# Altium schematic sheet M5-RelayDriver.SchDoc
size A4; ApprovedBy: -; CheckedBy: h.t.t.monfared; Author: h.t.t.monfared; Revision: 1.00; SheetNumber: 5; SheetTotal: 10; Project Code:: UFM Sensor Controller; Document Title:: Output Driver Sheet
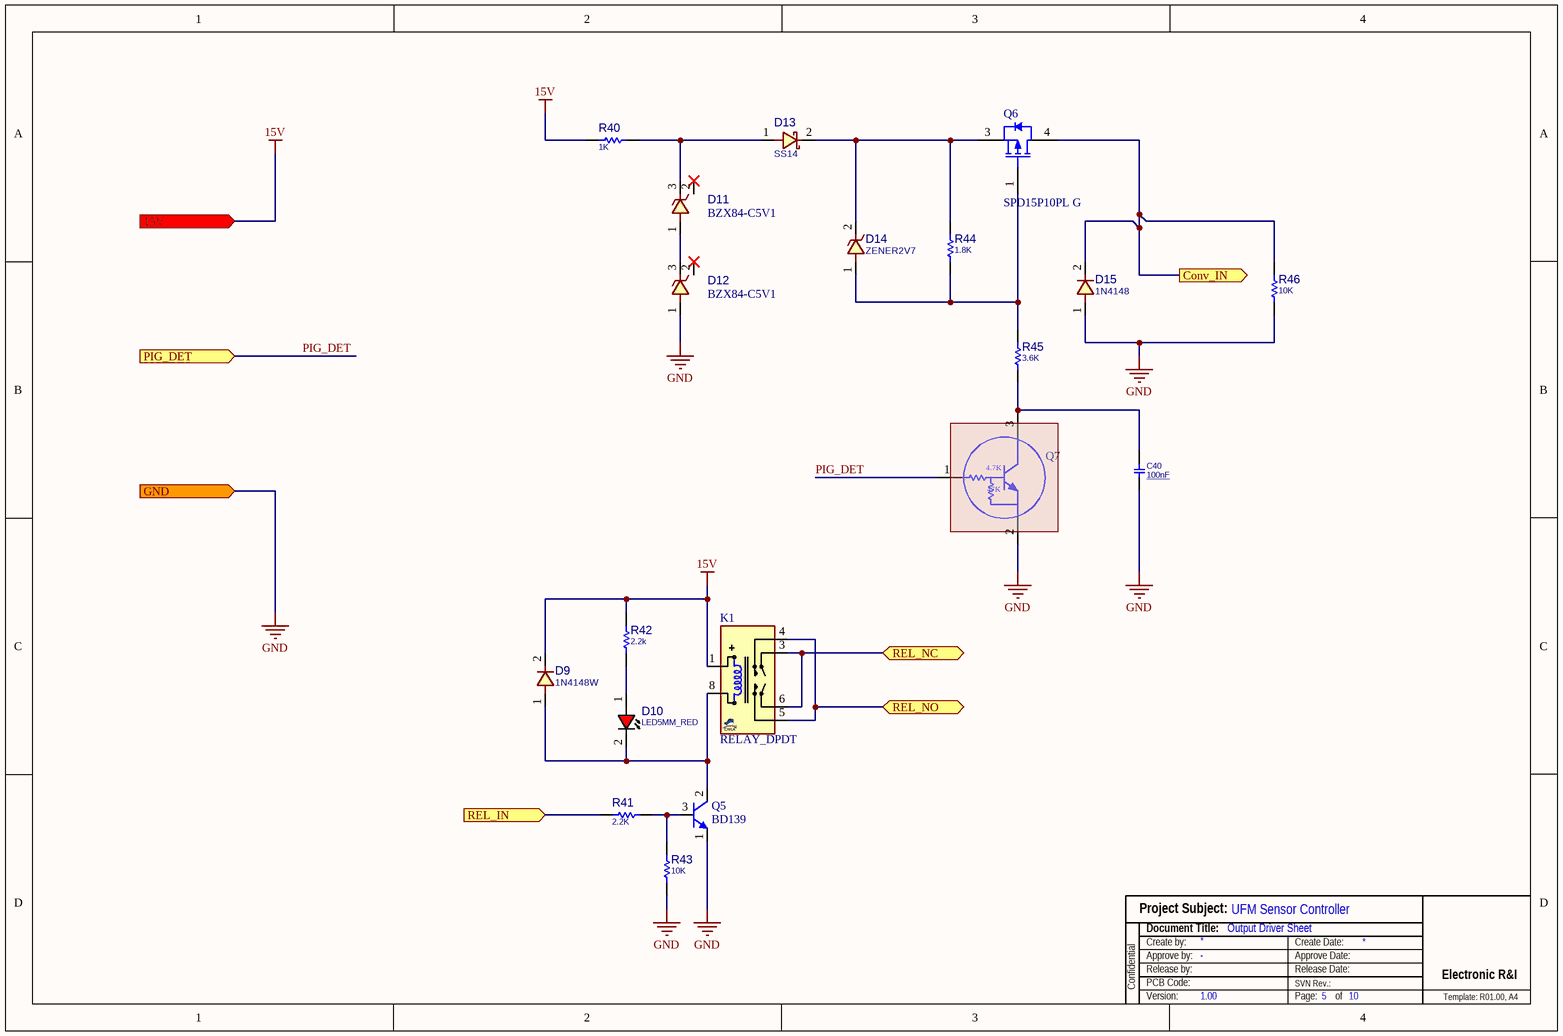
[diagram p0: M5-RelayDriver.SchDoc]

## Parts
C40  100nF  [C1206]
D9  1N4148W  [D_SOD123W]
D10  LED5MM_RED  [LED5MM_RED]
D11  MANF_P#: BZX84-C5V1  [SOT23_3]  (hidden comment: ZENER2V4)
D12  MANF_P#: BZX84-C5V1  [SOT23_3]  (hidden comment: ZENER2V4)
D13  SS14  [D_SMB]
D14  value ZENER2V7  [D0805]  (hidden comment: DIODE_SMD_ZENER_MM3Z2V7B)
D15  1N4148  [D_AX02_DO35]
K1  RELAY_DPDT  [REL_DPDT_8_2913]
Q5  BD139  [TO126_3]
Q6  SPD15P10PL G  [TO-252 (D-PAK)]
Q7  BCR116  [SOT23]  (value not drawn)
R40  1K  [R1206]
R41  2.2K  [R1206]
R42  2.2k  [R1206]
R43  10K  [R1206]
R44  1.8K  [R1206]
R45  3.6K  [R1206]
R46  10K  [R1206]

## Ports
15V (in), Conv_IN (out), GND (in), PIG_DET (in), REL_IN (in), REL_NC (bidir), REL_NO (bidir)

## Nets
15V: D9.2 K1.1(T1) R40.1 R42.2 ; port 15V
GND: C40.1 D12.1 D15.1 Q5.1(E) Q7.2(E) R43.1 R46.1 ; port GND
Conv_IN: D15.2 Q6.4(D) R46.2 ; port Conv_IN
PIG_DET: Q7.1(B) ; port PIG_DET
REL_IN: R41.1 ; port REL_IN
REL_NC: K1.3(COM1) K1.6(COM2) ; port REL_NC
REL_NO: K1.4(NO1) K1.5(NO2) ; port REL_NO
NetC40_2: C40.2 Q7.3(C) R45.1
NetD9_1: D9.1 D10.2(CATHODE) K1.8(T2) Q5.2(C)
NetD10_1: D10.1(ANODE) R42.1
NetD11_1: D11.1 D12.3
NetD11_3: D11.3 D13.1 R40.2
NetD13_2: D13.2 D14.2 Q6.3(S) R44.2
NetD14_1: D14.1 Q6.1(G) R44.1 R45.2
NetQ5_3: Q5.3(B) R41.2 R43.2

Not connected (* = marked no-connect by the designer): D11 2*; D12 2*

## Notes on the sheet
- Project Subject:
- Confidential
- Release by:
- Document Title:
- Create by:
- PCB Code:
- Approve by:
- SVN Rev.:
- Create Date:
- Release Date:
- Approve Date:
- Electronic R&I
- Version:
- Page:
- of
- Template: R01.00, A4
- (in symbol BCR116) 4.7K; 47K

## Library data of the parts
C40 = CAP_SMD_MLCC: CAP, MLCC, 1nF, 50V, C0G, 10%, 0402; MANF_P#: MANF_PART#; MANF: Murata; PARAM: C0G, 10%; PRICE: 100= 1$; DESC: CAP, MLCC, 1nF, 50V, C0G, 10%, 0402; PARAM2: 50V; ASSEMBLY: ASSEMBLY; VALUE: 100nF
D9 = DIODE_SMD_1N4148_SOD80: DIODE, FAST SWTICHING, 0.3A, 0.5W; DESC: DESCRIPTION; PARAM: 75V; PARAM2: 300mA, 0.5W; MANF_P#: 1N4148; MANF: MANF; ASSEMBLY: ASSEMBLY; PRICE: PRICE; VALUE: 1N4148W
D10 = LED_THD_5MM_RED: LED, THD, 5MM, RED; DESC: DESCRIPTION; MANF_P#: MANF_PART#; PARAM2: 2.2V; MANF: MANF; ASSEMBLY: ASSEMBLY; PRICE: PRICE; VALUE: LED5MM_RED
D11 D12 = DIODE_SMD_ZENER_BZX84-C2V4: DIODE, ZENER, 0.25W, 2.4V; MANF: NXP; DESC: DESCRIPTION; PARAM2: 5.1V, 0.9VF; PARAM: 0.25W, 10mA IF; ASSEMBLY: ASSEMBLY; PRICE: PRICE; VALUE: ZENER2V4
D13 = DIODE_SMD_SCHOTTKY_SS14: DIODE, SCHOTTKY, 40V, 1A; MANF: Vishay; DESC: DESCRIPTION; MANF_P#: SS14-E3; ASSEMBLY: ASSEMBLY; PRICE: PRICE; PARAM2: 1A; PARAM: 40V; VALUE: SS14
D14 = DIODE_SMD_ZENER_MM3Z2V7B: DIODE, ZENER, 0.2W, 2.7V; MANF: Fairchild; DESC: DESCRIPTION; PRICE: 0.036; MANF_P#: MM3Z2V7B; ASSEMBLY: ASSEMBLY; PARAM2: 0.2W; PARAM: 2.7V
D15 = DIODE_THD_1N4148_DO35: DIODE, FAST SWTICHING, THD; DESC: DESCRIPTION; PARAM: 75V; PARAM2: 0.3A; MANF: MANF; ASSEMBLY: ASSEMBLY; PRICE: PRICE; MANF_P#: 1N4148; VALUE: 1N4148
K1 = RELAY_DPST_8_2913_RT2: Relay, DPDT, 8P, 29X13mm, RT2, 400VAC/8A; MANF: TE; MANF_P#: RTE24012; PARAM2: 8A, 400VAC; PARAM: 12V, 30mA, 360Ohm; PRICE: 3$; Value: RELAY_DPDT
Q5 = NPN_BD139_TO126: BJT, NPN, 80V, 1.5A; MANF: FAIRCHILD; VALUE: BD139; MANF_P#: BD139
Q6 = ME11031101: Transistor-MOSFET,S,P,15A,100V,TO-252; Manufacturer Code1: 0000101173; Manufacturer Name1: Infineon; Unit Price (USD): Coming Soon; Function in Circuit: Please Add; Material Class: Transistor-FET; Description Farsi: ترانزيستور-ماسفت,S,P,15A,100V,TO-252; Voltage-Breakdown Drain Source: -100V; Type: MOSFET; Automotive Qualified: AEC-Q101; Polarity-N/P: P-CHANNEL; Temperature-Min Operation: -55°C; Packing: TAPE AND REEL; AltCode-1: ALTE594:ACTIVE; Thermal Resistance-RJA: 75(°K/W); Temperature-Max Operation: 175°C; AltMat-1: ME11028601; Number of Unit: 1; Resistance-ON (Ron): 200(mOhm); Current-Max Pulsed Drain: -60A; Power: 128W; Capacitance-Input: 1.49nF; Voltage-Max Gate Source: ±20V; AltMat-2: ME11031301; Current-Max Drain: -15A; Voltage-Threshold Gate: -1V; Material: ME11031101; ComponentLink5Description: DSH2053301RE: TDT_PowerMOSFET; Lead Free: YES; ComponentLink4Description: DSH2066440RE: TDT_Infineon; ComponentLink5URL: \\192.168.5.63\eRI_ComponentDatabase\Datasheets\SAP\DSH_2053301_00_1.PDF; ComponentLink1URL: \\192.168.5.63\eRI_ComponentDatabase\Datasheets\SAP\DSH_2045621_00_1.PDF; Package/Case: TO-252 (DPAK); ComponentLink3URL: \\192.168.5.63\eRI_ComponentDatabase\Datasheets\SAP\DSH_2084696_00_1.PDF; ComponentLink2Description: DSH2045618RE: Application Note-ON; Halogen Free: NOT MENTIONED; Temperature-Min Storage: -55°C; ComponentLink3Description: DSH2084696RE: DSH-PKG_Infineon; ComponentLink6URL: \\192.168.5.63\eRI_ComponentDatabase\Datasheets\SAP\DSH_2065146_00_1.PDF; Termination Style (SMD/THT): SMD; Manufacturer PN1: SPD15P10PL G; ComponentLink6Description: DSH2065146RE: TDT_TOSHIBA; ComponentLink2URL: \\192.168.5.63\eRI_ComponentDatabase\Datasheets\SAP\DSH_2045618_00_1.PDF; Voltage-Max Drain Source: -100V; ComponentLink4URL: \\192.168.5.63\eRI_ComponentDatabase\Datasheets\SAP\DSH_2066440_00_1.PDF; ComponentLink1Description: DSH2045621RE: Application Note-ON; Temperature-Max Storage: 175°C; RoHS: YES; Size (LxWxH)/(DxH): NA
Q7 = BCR116: NPN Silicon Digital Transistor
R40 R43 R46 = RES_SMD: RESISTOR, SMD; PARAM: -W; DESC: DESCRIPTION; DIST#: MOUSER; PARAM2: 1%; MANF_P#: -; MANF: -; ASSEMBLY: ASSEMBLY; PRICE: 100= 0.5$
  R40: VALUE: 1K
  R43 R46: VALUE: 10K
R41 = RES_SMD: RESISTOR, SMD; MANF_P#: RK73H1ETTP4701F; MANF: KOA SPEER; PARAM: 0.063W; DESC: DESCRIPTION; DIST#: MOUSER; PARAM2: 10%; ASSEMBLY: ASSEMBLY; PRICE: 100= 0.5$; VALUE: 2.2K
R42 = RES_SMD: RESISTOR, SMD; MANF_P#: RK73H1ETTP4701F; MANF: KOA SPEER; PARAM: 0.063W; DESC: DESCRIPTION; DIST#: MOUSER; PARAM2: 1%; ASSEMBLY: ASSEMBLY; PRICE: 100= 0.5$; VALUE: 2.2k
R44 R45 = RES_SMD_1206: RESISTOR, SMD; PARAM: -W; DESC: DESCRIPTION; DIST#: MOUSER; PARAM2: 1%; MANF_P#: -; MANF: -; ASSEMBLY: ASSEMBLY; PRICE: 100= 0.5$
  R44: VALUE: 1.8K
  R45: VALUE: 3.6K